# EAGLE design FLD Logic 2 (EAGLE 6.5.0)
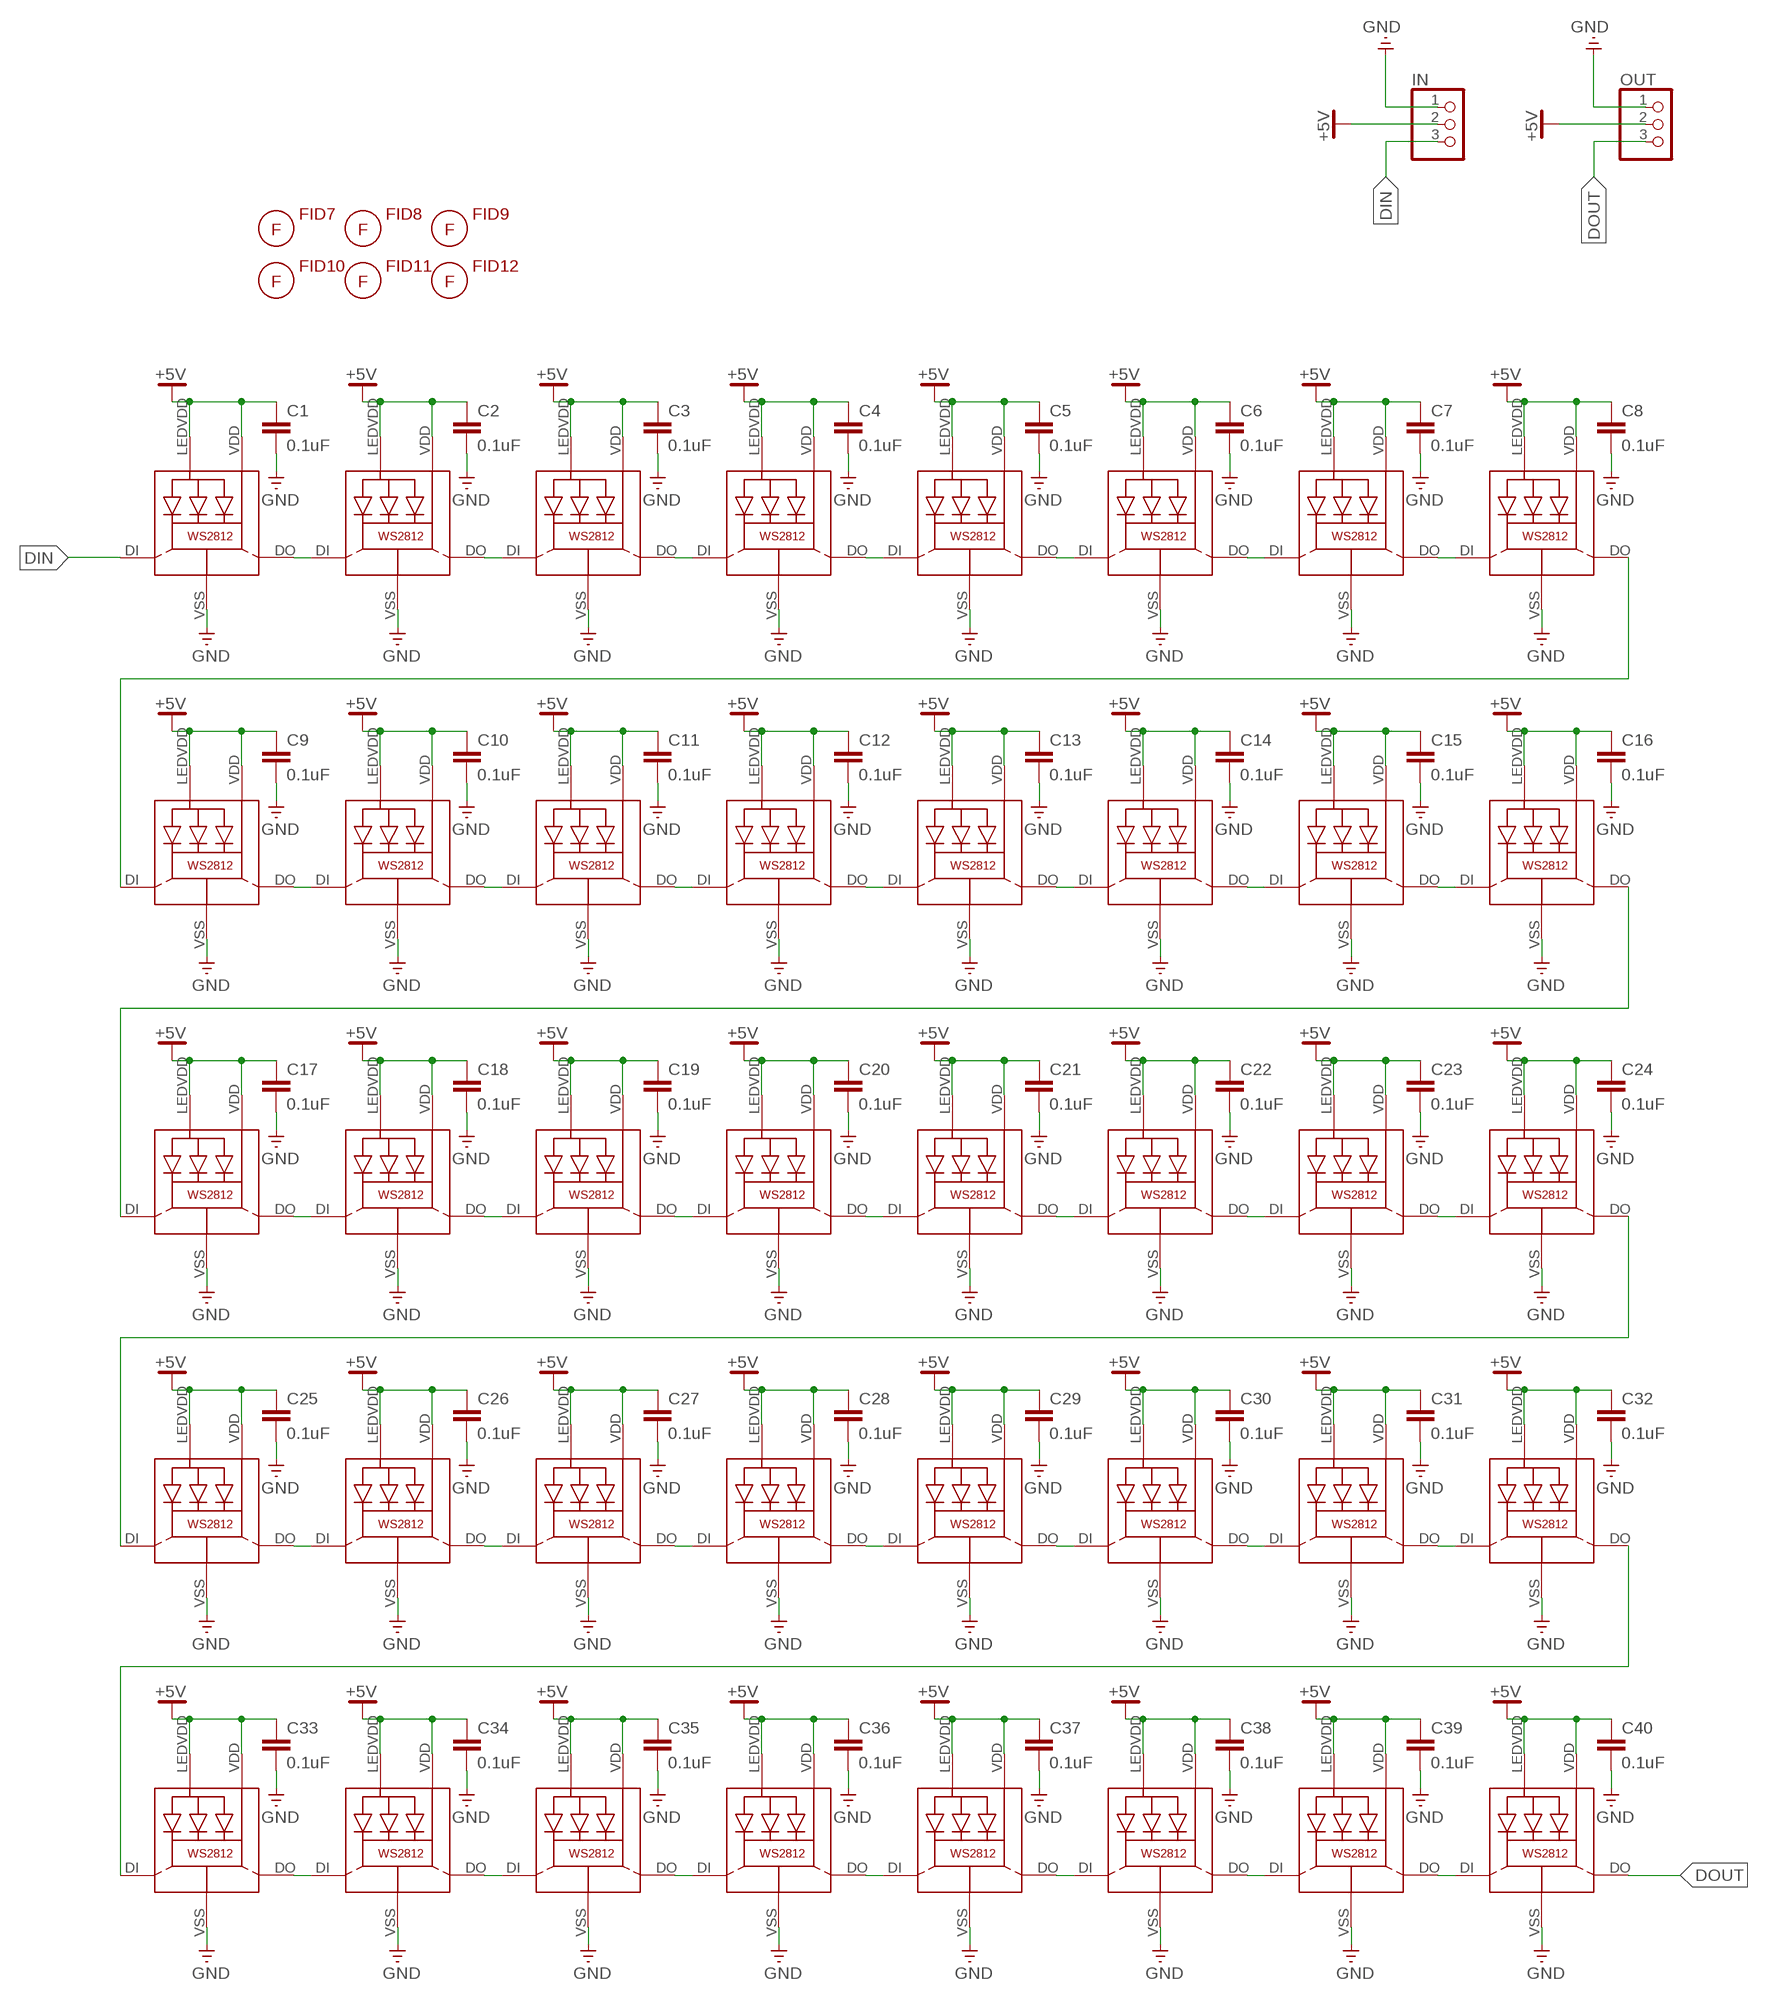
[diagram p0: schematic, sheet 1]

## Parts
C1  0.1uF  CAP0805  [0805]
C2  0.1uF  CAP0805  [0805]
C3  0.1uF  CAP0805  [0805]
C4  0.1uF  CAP0805  [0805]
C5  0.1uF  CAP0805  [0805]
C6  0.1uF  CAP0805  [0805]
C7  0.1uF  CAP0805  [0805]
C8  0.1uF  CAP0805  [0805]
C9  0.1uF  CAP0805  [0805]
C10  0.1uF  CAP0805  [0805]
C11  0.1uF  CAP0805  [0805]
C12  0.1uF  CAP0805  [0805]
C13  0.1uF  CAP0805  [0805]
C14  0.1uF  CAP0805  [0805]
C15  0.1uF  CAP0805  [0805]
C16  0.1uF  CAP0805  [0805]
C17  0.1uF  CAP0805  [0805]
C18  0.1uF  CAP0805  [0805]
C19  0.1uF  CAP0805  [0805]
C20  0.1uF  CAP0805  [0805]
C21  0.1uF  CAP0805  [0805]
C22  0.1uF  CAP0805  [0805]
C23  0.1uF  CAP0805  [0805]
C24  0.1uF  CAP0805  [0805]
C25  0.1uF  CAP0805  [0805]
C26  0.1uF  CAP0805  [0805]
C27  0.1uF  CAP0805  [0805]
C28  0.1uF  CAP0805  [0805]
C29  0.1uF  CAP0805  [0805]
C30  0.1uF  CAP0805  [0805]
C31  0.1uF  CAP0805  [0805]
C32  0.1uF  CAP0805  [0805]
C33  0.1uF  CAP0805  [0805]
C34  0.1uF  CAP0805  [0805]
C35  0.1uF  CAP0805  [0805]
C36  0.1uF  CAP0805  [0805]
C37  0.1uF  CAP0805  [0805]
C38  0.1uF  CAP0805  [0805]
C39  0.1uF  CAP0805  [0805]
C40  0.1uF  CAP0805  [0805]
FID7  FIDUCIAL  [FIDUCIAL_G15]
FID8  FIDUCIAL  [FIDUCIAL_G15]
FID9  FIDUCIAL  [FIDUCIAL_G15]
FID10  FIDUCIAL  [FIDUCIAL_G15]
FID11  FIDUCIAL  [FIDUCIAL_G15]
FID12  FIDUCIAL  [FIDUCIAL_G15]
IN  PINHD-1X3  [1X03]
LED1  WS2812  [WS2812]
LED2  WS2812  [WS2812]
LED3  WS2812  [WS2812]
LED4  WS2812  [WS2812]
LED5  WS2812  [WS2812]
LED6  WS2812  [WS2812]
LED7  WS2812  [WS2812]
LED8  WS2812  [WS2812]
LED9  WS2812  [WS2812]
LED10  WS2812  [WS2812]
LED11  WS2812  [WS2812]
LED12  WS2812  [WS2812]
LED13  WS2812  [WS2812]
LED14  WS2812  [WS2812]
LED15  WS2812  [WS2812]
LED16  WS2812  [WS2812]
LED17  WS2812  [WS2812]
LED18  WS2812  [WS2812]
LED19  WS2812  [WS2812]
LED20  WS2812  [WS2812]
LED21  WS2812  [WS2812]
LED22  WS2812  [WS2812]
LED23  WS2812  [WS2812]
LED24  WS2812  [WS2812]
LED25  WS2812  [WS2812]
LED26  WS2812  [WS2812]
LED27  WS2812  [WS2812]
LED28  WS2812  [WS2812]
LED29  WS2812  [WS2812]
LED30  WS2812  [WS2812]
LED31  WS2812  [WS2812]
LED32  WS2812  [WS2812]
LED33  WS2812  [WS2812]
LED34  WS2812  [WS2812]
LED35  WS2812  [WS2812]
LED36  WS2812  [WS2812]
LED37  WS2812  [WS2812]
LED38  WS2812  [WS2812]
LED39  WS2812  [WS2812]
LED40  WS2812  [WS2812]
OUT  PINHD-1X3  [1X03]

## Nets
+5V [supply]: C1.1 C2.1 C3.1 C4.1 C5.1 C6.1 C7.1 C8.1 C9.1 C10.1 C11.1 C12.1 C13.1 C14.1 C15.1 C16.1 C17.1 C18.1 C19.1 C20.1 C21.1 C22.1 C23.1 C24.1 C25.1 C26.1 C27.1 C28.1 C29.1 C30.1 C31.1 C32.1 C33.1 C34.1 C35.1 C36.1 C37.1 C38.1 C39.1 C40.1 IN.2 LED1.LEDVDD LED1.VDD LED2.LEDVDD LED2.VDD LED3.LEDVDD LED3.VDD LED4.LEDVDD LED4.VDD LED5.LEDVDD LED5.VDD LED6.LEDVDD LED6.VDD LED7.LEDVDD LED7.VDD LED8.LEDVDD LED8.VDD LED9.LEDVDD LED9.VDD LED10.LEDVDD LED10.VDD LED11.LEDVDD LED11.VDD LED12.LEDVDD LED12.VDD LED13.LEDVDD LED13.VDD LED14.LEDVDD LED14.VDD LED15.LEDVDD LED15.VDD LED16.LEDVDD LED16.VDD LED17.LEDVDD LED17.VDD LED18.LEDVDD LED18.VDD LED19.LEDVDD LED19.VDD LED20.LEDVDD LED20.VDD LED21.LEDVDD LED21.VDD LED22.LEDVDD LED22.VDD LED23.LEDVDD LED23.VDD LED24.LEDVDD LED24.VDD LED25.LEDVDD LED25.VDD LED26.LEDVDD LED26.VDD LED27.LEDVDD LED27.VDD LED28.LEDVDD LED28.VDD LED29.LEDVDD LED29.VDD LED30.LEDVDD LED30.VDD LED31.LEDVDD LED31.VDD LED32.LEDVDD LED32.VDD LED33.LEDVDD LED33.VDD LED34.LEDVDD LED34.VDD LED35.LEDVDD LED35.VDD LED36.LEDVDD LED36.VDD LED37.LEDVDD LED37.VDD LED38.LEDVDD LED38.VDD LED39.LEDVDD LED39.VDD LED40.LEDVDD LED40.VDD OUT.2
DIN: IN.3 LED1.DI
DOUT: LED40.DO OUT.3
GND [supply]: C1.2 C2.2 C3.2 C4.2 C5.2 C6.2 C7.2 C8.2 C9.2 C10.2 C11.2 C12.2 C13.2 C14.2 C15.2 C16.2 C17.2 C18.2 C19.2 C20.2 C21.2 C22.2 C23.2 C24.2 C25.2 C26.2 C27.2 C28.2 C29.2 C30.2 C31.2 C32.2 C33.2 C34.2 C35.2 C36.2 C37.2 C38.2 C39.2 C40.2 IN.1 LED1.VSS(GND) LED2.VSS(GND) LED3.VSS(GND) LED4.VSS(GND) LED5.VSS(GND) LED6.VSS(GND) LED7.VSS(GND) LED8.VSS(GND) LED9.VSS(GND) LED10.VSS(GND) LED11.VSS(GND) LED12.VSS(GND) LED13.VSS(GND) LED14.VSS(GND) LED15.VSS(GND) LED16.VSS(GND) LED17.VSS(GND) LED18.VSS(GND) LED19.VSS(GND) LED20.VSS(GND) LED21.VSS(GND) LED22.VSS(GND) LED23.VSS(GND) LED24.VSS(GND) LED25.VSS(GND) LED26.VSS(GND) LED27.VSS(GND) LED28.VSS(GND) LED29.VSS(GND) LED30.VSS(GND) LED31.VSS(GND) LED32.VSS(GND) LED33.VSS(GND) LED34.VSS(GND) LED35.VSS(GND) LED36.VSS(GND) LED37.VSS(GND) LED38.VSS(GND) LED39.VSS(GND) LED40.VSS(GND) OUT.1
N$1: LED1.DO LED2.DI
N$2: LED3.DO LED4.DI
N$3: LED2.DO LED3.DI
N$4: LED5.DO LED6.DI
N$5: LED7.DO LED8.DI
N$6: LED6.DO LED7.DI
N$7: LED4.DO LED5.DI
N$8: LED9.DO LED10.DI
N$9: LED11.DO LED12.DI
N$10: LED10.DO LED11.DI
N$11: LED13.DO LED14.DI
N$12: LED15.DO LED16.DI
N$13: LED14.DO LED15.DI
N$14: LED12.DO LED13.DI
N$15: LED17.DO LED18.DI
N$16: LED19.DO LED20.DI
N$17: LED18.DO LED19.DI
N$18: LED21.DO LED22.DI
N$19: LED23.DO LED24.DI
N$20: LED22.DO LED23.DI
N$21: LED20.DO LED21.DI
N$22: LED25.DO LED26.DI
N$23: LED27.DO LED28.DI
N$24: LED26.DO LED27.DI
N$25: LED29.DO LED30.DI
N$26: LED31.DO LED32.DI
N$27: LED30.DO LED31.DI
N$28: LED28.DO LED29.DI
N$29: LED8.DO LED9.DI
N$30: LED16.DO LED17.DI
N$31: LED24.DO LED25.DI
N$32: LED33.DO LED34.DI
N$33: LED35.DO LED36.DI
N$34: LED34.DO LED35.DI
N$35: LED37.DO LED38.DI
N$36: LED39.DO LED40.DI
N$37: LED38.DO LED39.DI
N$38: LED36.DO LED37.DI
N$39: LED32.DO LED33.DI

## Library data of the parts
C1-C40 = SparkFun-Capacitors:CAP: Capacitor Standard 0603 ceramic capacitor, and 0.1" leaded capacitor.
FID7-FID12 = SmallBatchLibPre1:FIDUCIAL
IN OUT = adafruit:PINHD-1X3: PIN HEADER
LED1-LED40 = rseries:WS2812

## Net classes
1 supply: width 0.406 mm, drill 0.33 mm, clearance 0.203 mm

## Board
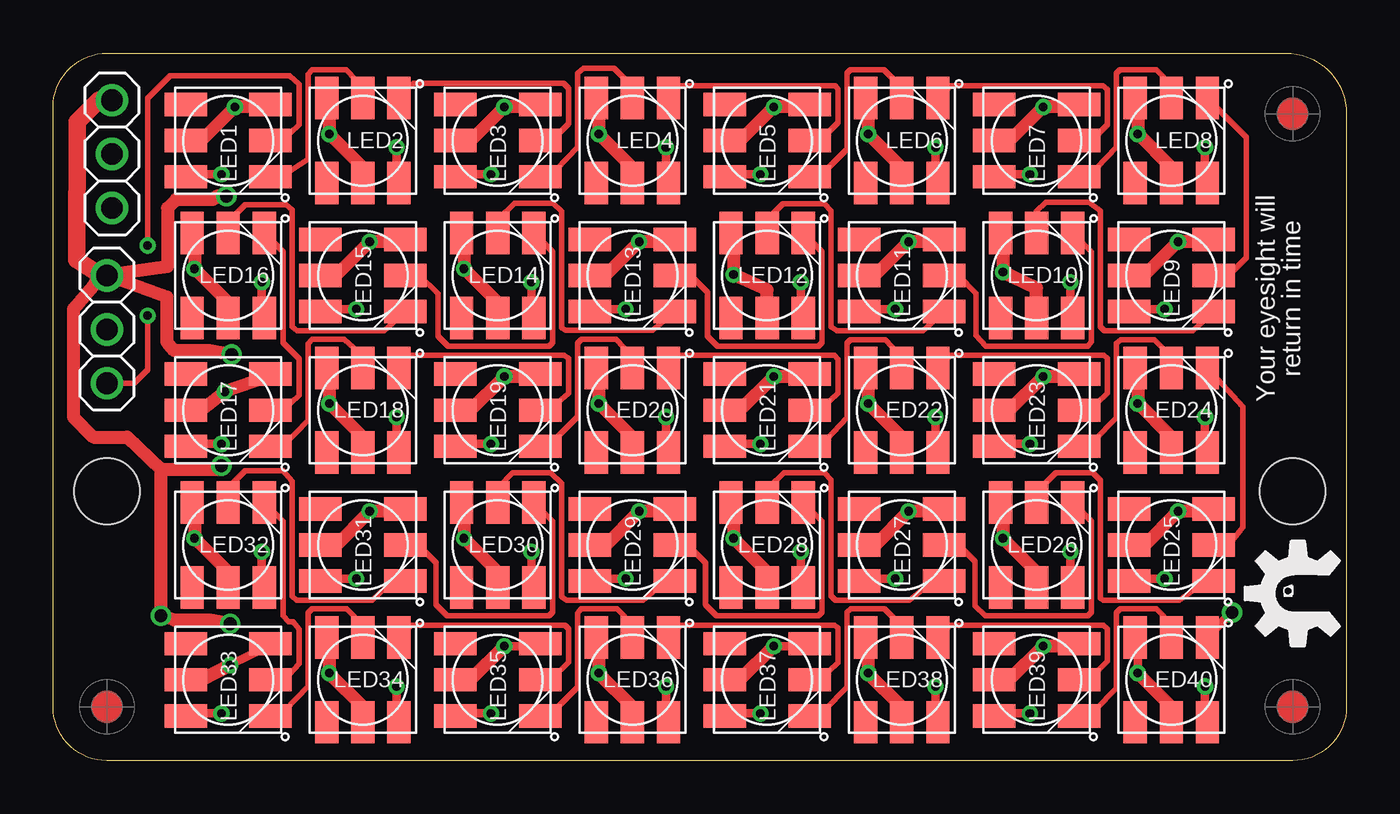
[diagram p1: board, top side]
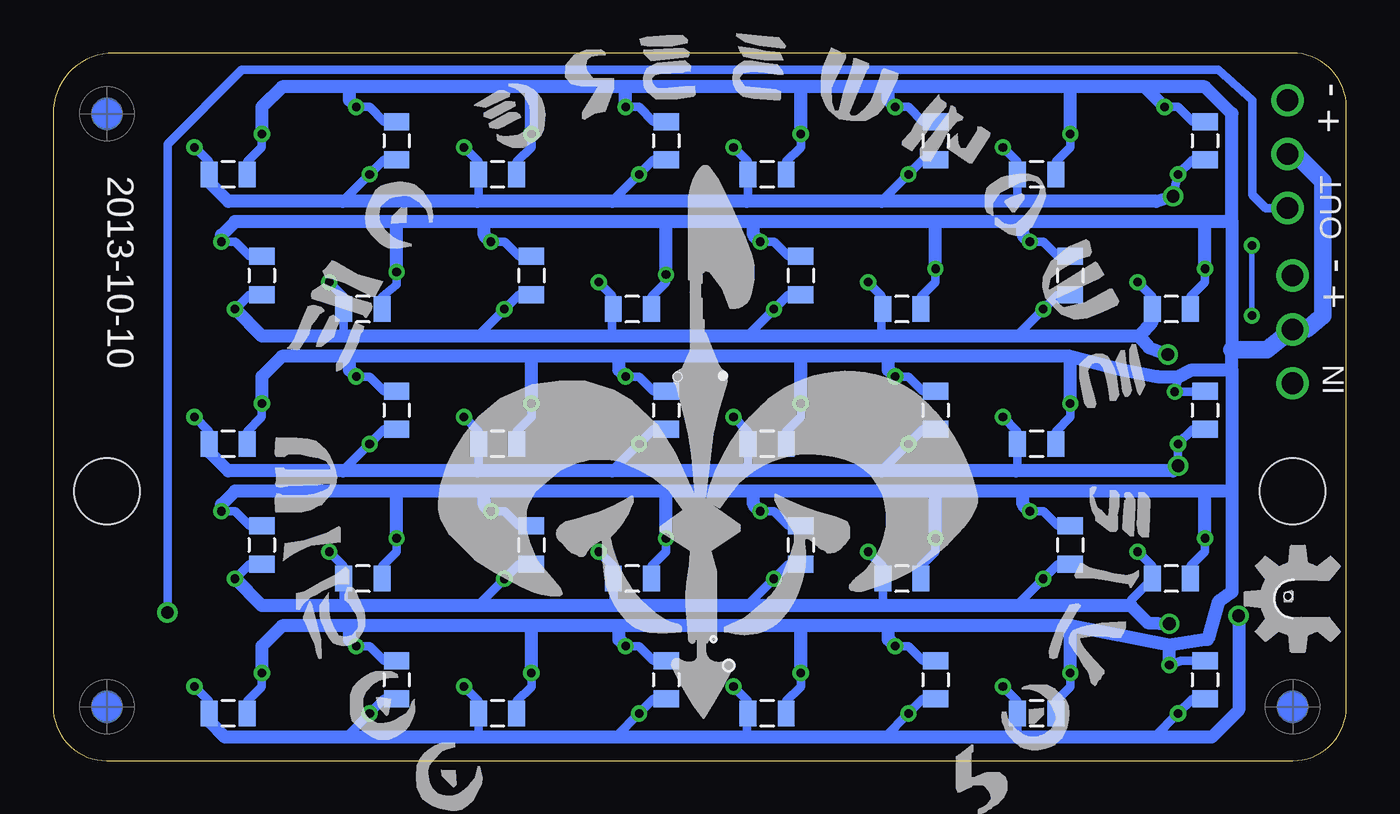
[diagram p2: board, bottom side, seen from below]

Size 60.96 x 33.34 mm. Coordinates in mm from the lower left corner, seen from the top.
Outline: 0,2.54 0,30.78 arc-90 2.56,33.34 58.1,33.34 arc-90 60.96,30.48 60.96,2.54 arc-90 58.42,0 2.54,0 arc-90 0,2.54
Copper layers (1*16): Top 0.0356mm / dielectric 1.5011mm / Bottom 0.0356mm
Design rules "LaenPCBOrder *": minimum track width 10mil, minimum drill 13mil, track to track 6mil, track to pad 6mil, pad to pad 6mil, via to via 6mil, smd to smd 6mil, copper to edge 15mil, drill to drill 6mil, minimum pad ring 7mil, minimum via ring 7mil, stop-mask expansion 4mil, vias tented up to drill 0mil, thermal gap 10mil
Holes 3.1 mm at 2.54,12.7 58.42,12.7

### Footprints (pad centres in the part's own frame; a part is rotated, then mirrored left to right if it is on the bottom)
0805 = smd 0.8 x 1.2: 1 -0.9,0; 2 0.9,0
1X03 = drill 1.016: 1 -2.54,0; 2 0,0; 3 2.54,0
WS2812 = smd 2 x 1.1: DI 2,0; DO 2,-1.7; LEDVDD -2,0; NC -2,1.7; VDD 2,1.7; VSS -2,-1.7

### Placement (x,y rotation side)
C1  6.67,29.21 270 bottom
C2  14.61,27.62 180 bottom
C3  19.37,29.21 270 bottom
C4  27.3,27.62 180 bottom
C5  32.07,29.21 270 bottom
C6  40.01,27.62 180 bottom
C7  44.77,29.21 270 bottom
C8  52.7,27.62 180 bottom
C9  51.12,22.86 270 bottom
C10  46.35,21.27 180 bottom
C11  38.42,22.86 270 bottom
C12  33.66,21.27 180 bottom
C13  25.72,22.86 270 bottom
C14  20.95,21.27 180 bottom
C15  13.02,22.86 270 bottom
C16  8.26,21.27 180 bottom
C17  6.67,16.51 270 bottom
C18  14.61,14.92 180 bottom
C19  19.37,16.51 270 bottom
C20  27.3,14.92 180 bottom
C21  32.07,16.51 270 bottom
C22  40.01,14.92 180 bottom
C23  44.77,16.51 270 bottom
C24  52.7,14.92 180 bottom
C25  51.12,10.16 270 bottom
C26  46.35,8.57 180 bottom
C27  38.42,10.16 270 bottom
C28  33.66,8.57 180 bottom
C29  25.72,10.16 270 bottom
C30  20.95,8.57 180 bottom
C31  13.02,10.16 270 bottom
C32  8.26,8.57 180 bottom
C33  6.67,3.81 270 bottom
C34  14.61,2.22 180 bottom
C35  19.37,3.81 270 bottom
C36  27.3,2.22 180 bottom
C37  32.07,3.81 270 bottom
C38  40.01,2.22 180 bottom
C39  44.77,3.81 270 bottom
C40  52.7,2.22 180 bottom
FID7  2.54,2.54 0 top
FID8  58.42,30.48 0 top
FID9  58.42,2.54 0 top
FID10  2.54,2.54 0 bottom
FID11  58.42,2.54 0 bottom
FID12  58.42,30.48 0 bottom
IN  2.54,20.32 270 top
LED1  8.26,29.21 0 top
LED2  14.61,29.21 90 top
LED3  20.95,29.21 0 top
LED4  27.3,29.21 90 top
LED5  33.66,29.21 0 top
LED6  40.01,29.21 90 top
LED7  46.35,29.21 0 top
LED8  52.7,29.21 90 top
LED9  52.7,22.86 0 top
LED10  46.35,22.86 90 top
LED11  40.01,22.86 0 top
LED12  33.66,22.86 90 top
LED13  27.3,22.86 0 top
LED14  20.95,22.86 90 top
LED15  14.61,22.86 0 top
LED16  8.26,22.86 90 top
LED17  8.26,16.51 0 top
LED18  14.61,16.51 90 top
LED19  20.95,16.51 0 top
LED20  27.3,16.51 90 top
LED21  33.66,16.51 0 top
LED22  40.01,16.51 90 top
LED23  46.35,16.51 0 top
LED24  52.7,16.51 90 top
LED25  52.7,10.16 0 top
LED26  46.35,10.16 90 top
LED27  40.01,10.16 0 top
LED28  33.66,10.16 90 top
LED29  27.3,10.16 0 top
LED30  20.95,10.16 90 top
LED31  14.61,10.16 0 top
LED32  8.26,10.16 90 top
LED33  8.26,3.81 0 top
LED34  14.61,3.81 90 top
LED35  20.95,3.81 0 top
LED36  27.3,3.81 90 top
LED37  33.66,3.81 0 top
LED38  40.01,3.81 90 top
LED39  46.35,3.81 0 top
LED40  52.7,3.81 90 top
OUT  2.78,28.57 270 top
U$1  [ROYAL-ENGINEERS-OF-NABOO-BOTTOM-LARGE]  30.48,0 0 top
U$2  [RSERIES-OSHW-LOGO-MEDIUM-BOTTOM]  59.69,7.87 90 top
U$3  [RSERIES-OSHW-LOGO-MEDIUM-BOTTOM]  1.27,7.62 90 bottom

### Tracks (layer width: path | path; a pad name or v marks a point on that pad's centre or on a via)
+5V  (via drill 0.41)
  Top 0.406: v8.35,4.51 10.14,5.4 LED33.VDD | v21.27,5.4 22.84,5.4 LED35.VDD | 16.49,11.75 LED31.VDD | v33.97,5.4 35.54,5.4 LED37.VDD | 48.24,5.4 LED39.VDD | 29.19,11.75 LED29.VDD | 41.89,11.75 LED27.VDD | v51.12,4.13 51.12,5.7 LED40.VDD | 54.59,11.75 LED25.VDD | 51.12,18.4 LED24.VDD | 54.59,24.45 LED9.VDD | 48.24,18.1 LED23.VDD | 41.89,24.45 LED11.VDD | 35.54,18.1 LED21.VDD | 29.19,24.45 LED13.VDD | 22.84,18.1 LED19.VDD | 16.49,24.45 LED15.VDD | 22.84,30.8 LED3.VDD | 35.54,30.8 LED5.VDD | 48.24,30.8 LED7.VDD | 51.12,31.1 LED8.VDD
  Top 0.61: 22.84,30.8 v21.27,30.8 19.68,29.21 LED3.LEDVDD | 16.49,24.45 v14.92,24.45 13.34,22.86 LED15.LEDVDD | LED14.VDD 19.37,24.75 v19.37,23.18 20.95,21.59 LED14.LEDVDD | 29.19,24.45 v27.62,24.45 26.04,22.86 LED13.LEDVDD | LED4.VDD 25.72,31.1 v25.72,29.53 27.3,27.94 LED4.LEDVDD | 35.54,30.8 v33.97,30.8 32.38,29.21 LED5.LEDVDD | LED12.VDD 32.07,24.75 v32.07,22.9 33.66,22.18 LED12.LEDVDD | LED6.VDD 38.42,31.1 v38.42,29.53 40.01,27.94 LED6.LEDVDD | 48.24,30.8 v46.67,30.8 45.09,29.21 LED7.LEDVDD | 51.12,31.1 v51.12,29.53 52.7,27.94 LED8.LEDVDD | 54.59,24.45 v53.02,24.45 51.44,22.86 LED9.LEDVDD | 41.89,24.45 v40.32,24.45 38.73,22.86 LED11.LEDVDD | 51.12,18.4 v51.12,16.83 52.7,15.24 LED24.LEDVDD | 48.24,18.1 v46.67,18.1 45.09,16.51 LED23.LEDVDD | LED22.VDD 38.42,18.4 v38.42,16.83 40.01,15.24 LED22.LEDVDD | 35.54,18.1 v33.97,18.1 32.38,16.51 LED21.LEDVDD | 54.59,11.75 v53.02,11.75 51.44,10.16 LED25.LEDVDD | LED26.VDD 44.77,12.05 v44.77,10.48 46.35,8.89 LED26.LEDVDD | 41.89,11.75 v40.32,11.75 38.73,10.16 LED27.LEDVDD | LED28.VDD 32.07,12.05 v32.07,10.48 33.66,8.89 LED28.LEDVDD | 29.19,11.75 v27.62,11.75 26.04,10.16 LED29.LEDVDD | LED20.VDD 25.72,18.4 v25.72,16.83 27.3,15.24 LED20.LEDVDD | LED30.VDD 19.37,12.05 v19.37,10.48 20.95,8.89 LED30.LEDVDD | 22.84,18.1 v21.27,18.1 19.68,16.51 LED19.LEDVDD | LED18.VDD 13.02,18.4 v13.02,16.83 14.61,15.24 LED18.LEDVDD | 16.49,11.75 v14.92,11.75 13.34,10.16 LED31.LEDVDD | LED34.VDD 13.02,5.7 v13.02,4.13 14.61,2.54 LED34.LEDVDD | LED36.VDD 25.72,5.7 v25.72,4.13 27.3,2.54 LED36.LEDVDD | LED38.VDD 38.42,5.7 v38.42,4.13 40.01,2.54 LED38.LEDVDD
  Top 0.61: 48.24,5.4 v46.67,5.4 45.09,3.81 LED39.LEDVDD | LED32.VDD 6.67,12.05 v6.67,10.48 8.26,8.89 LED32.LEDVDD | LED17.VDD 10.14,18.1 v8.1,17.38 6.99,16.51 LED17.LEDVDD | LED16.VDD 6.67,24.75 v6.67,23.18 8.26,21.59 LED16.LEDVDD | LED1.VDD 10.14,30.8 v8.57,30.8 6.99,29.21 LED1.LEDVDD | LED2.VDD 13.02,31.1 v13.02,29.53 14.61,27.94 LED2.LEDVDD | LED10.LEDVDD 46.35,22.27 v44.77,23.02 44.77,24.75 LED10.VDD | LED33.LEDVDD 6.99,3.81 v8.35,4.51 | LED40.LEDVDD 52.7,2.54 v51.12,4.13 | LED37.LEDVDD 32.38,3.81 v33.97,5.4 | LED35.LEDVDD 19.68,3.81 v21.27,5.4
  Bottom 0.406: C33.1 7.25,4.71 7.78,4.7 v8.35,4.51 | C34.1 13.71,2.81 13.02,3.49 v13.02,4.13 | C35.1 19.95,4.71 20.64,5.4 v21.27,5.4 | C32.1 7.36,9.15 6.67,9.84 v6.67,10.48 | C31.1 13.6,11.06 14.29,11.75 v14.92,11.75 | C30.1 20.05,9.15 19.37,9.84 v19.37,10.48 | C36.1 26.41,2.81 25.72,3.49 v25.72,4.13 | C37.1 32.65,4.71 33.34,5.4 v33.97,5.4 | C38.1 39.1,2.81 38.42,3.49 v38.42,4.13 | C39.1 45.35,4.71 46.04,5.4 v46.67,5.4 | C29.1 26.3,11.06 26.99,11.75 v27.62,11.75 | C28.1 32.76,9.15 32.07,9.84 v32.07,10.48 | C27.1 39,11.06 39.69,11.75 v40.32,11.75 | C26.1 45.45,9.15 44.77,9.84 v44.77,10.48 | C40.1 51.8,2.81 51.12,3.49 v51.12,4.13 | C25.1 51.7,11.06 52.39,11.75 v53.02,11.75 | C24.1 51.8,15.51 51.12,16.19 v51.12,16.83 | C9.1 51.7,23.76 52.39,24.45 v53.02,24.45 | C10.1 45.45,21.86 44.77,22.42 v44.77,23.02 | C23.1 45.35,17.41 46.04,18.1 v46.67,18.1 | C22.1 39.1,15.51 38.42,16.19 v38.42,16.83 | C11.1 39,23.76 39.69,24.45 v40.32,24.45 | C21.1 32.65,17.41 33.34,18.1 v33.97,18.1 | C20.1 26.41,15.51 25.72,16.19 v25.72,16.83 | C12.1 32.76,21.86 32.07,22.54 v32.07,22.9 | C13.1 26.3,23.76 26.99,24.45 v27.62,24.45 | C14.1 20.05,21.86 19.37,22.54 v19.37,23.18 | C19.1 19.95,17.41 20.64,18.1 v21.27,18.1 | C18.1 13.71,15.51 13.02,16.19 v13.02,16.83 | C15.1 13.6,23.76 14.29,24.45 v14.92,24.45 | C16.1 7.36,21.86 6.67,22.54 v6.67,23.18 | C17.1 7.25,17.41 7.28,17.38 v8.1,17.38 7.94,17.94 7.94,18.1 | C1.1 7.25,30.11 7.94,30.8 v8.57,30.8 | C2.1 13.71,28.2 13.02,28.89 v13.02,29.53 | C3.1 19.95,30.11 20.64,30.8 v21.27,30.8 | C4.1 26.41,28.2 25.72,28.89 v25.72,29.53 | C5.1 32.65,30.11 33.34,30.8 v33.97,30.8 | C6.1 39.1,28.2 38.42,28.89 v38.42,29.53
  Bottom 0.406: C7.1 45.35,30.11 46.04,30.8 v46.67,30.8 | C8.1 51.8,28.2 51.12,28.89 v51.12,29.53
  Bottom 0.61: 9.53,31.75 6.67,31.75 5.4,30.48 5.4,25.4 | 9.53,31.75 13.02,31.75 | 13.02,31.75 21.59,31.75 | 21.59,31.75 25.72,31.75 | 25.72,31.75 33.97,31.75 | 33.97,31.75 38.42,31.75 | 38.42,31.75 46.99,31.75 | 46.99,31.75 50.16,31.75 51.12,30.8 v51.12,29.53 | v13.02,29.53 13.02,31.75 | v21.27,30.8 21.59,31.11 21.59,31.75 | v25.72,29.53 25.72,31.75 | v33.97,30.8 33.97,31.75 | v38.42,29.53 38.42,31.75 | v46.67,30.8 46.99,31.11 46.99,31.75 | 5.4,25.4 6.67,25.4 | 6.67,25.4 15.24,25.4 | 15.24,25.4 19.37,25.4 | 19.37,25.4 27.94,25.4 | 27.94,25.4 32.07,25.4 | 32.07,25.4 40.64,25.4 | 40.64,25.4 44.77,25.4 | 44.77,25.4 52.39,25.4 53.02,24.77 v53.02,24.45 | v14.92,24.45 15.24,24.77 15.24,25.4 | v19.37,23.18 19.37,25.4 | v27.62,24.45 27.94,24.77 27.94,25.4 | v40.32,24.45 40.64,24.77 40.64,25.4 | v32.07,22.9 32.07,25.4 | v44.77,23.02 44.77,25.4 | 13.02,19.05 21.59,19.05 | 21.59,19.05 25.72,19.05 | 25.72,19.05 34.29,19.05 | 34.29,19.05 38.42,19.05 | 38.42,19.05 46.99,19.05 | 46.99,19.05 50.16,19.05 51.12,18.1 v51.12,16.83 | v13.02,16.83 13.02,19.05 | v21.27,18.1 21.59,18.41 21.59,19.05 | v33.97,18.1 34.29,18.41 34.29,19.05 | v46.67,18.1 46.99,18.41 46.99,19.05 | v38.42,16.83 38.42,19.05 | v25.72,16.83 25.72,19.05 | 5.4,12.7 6.67,12.7 | 6.67,12.7 15.24,12.7 | 15.24,12.7 19.37,12.7 | 19.37,12.7 27.94,12.7 | 27.94,12.7 32.07,12.7 | 32.07,12.7 40.64,12.7 | 40.64,12.7 44.77,12.7 | 44.77,12.7 52.39,12.7 53.02,12.06 v53.02,11.75 | v14.92,11.75 15.24,12.06 15.24,12.7 | v19.37,10.48 19.37,12.7 | v27.62,11.75 27.94,12.06 27.94,12.7 | v32.07,10.48 32.07,12.7 | v40.32,11.75 40.64,12.06 40.64,12.7 | v44.77,10.48 44.77,12.7 | v8.35,4.51 8.35,5.43 | 8.35,5.43 13.02,6.35 | 13.02,6.35 21.59,6.35
  Bottom 0.61: 21.59,6.35 25.72,6.35 | 25.72,6.35 34.29,6.35 | 34.29,6.35 38.42,6.35 | 38.42,6.35 46.99,6.35 | 46.99,6.35 50.16,6.35 51.12,5.4 v51.12,4.13 | v13.02,4.13 13.02,6.35 | v21.27,5.4 21.59,5.71 21.59,6.35 | v25.72,4.13 25.72,6.35 | v33.97,5.4 34.29,5.71 34.29,6.35 | v38.42,4.13 38.42,6.35 | v46.67,5.4 46.99,5.71 46.99,6.35 | 5.4,25.4 5.4,19.37 5.4,18.41 | 5.4,18.41 5.4,12.7 | 5.4,12.7 5.4,7.94 6.03,7.49 6.54,5.71 8.35,5.43 | v6.67,10.48 6.67,12.7 | 13.02,19.05 10.56,18.41 8.89,18.1 7.94,18.1 7.3,18.41 5.4,18.41 | v6.67,23.18 6.67,25.4 | v8.57,30.8 9.53,31.75
  Bottom 0.813: OUT.2 2.38,28.57 1.11,27.3 1.11,20.95 1.84,20.35 IN.2 3.75,19.37 5.4,19.37
DIN  (via drill 0.41)
  Top 0.254: LED1.DI 10.8,29.21 11.61,29.97 11.61,31.86 11.14,32.28 5.53,32.28 4.46,31.2 v4.46,24.27 | v4.46,20.97 4.46,18.41 3.83,17.78 IN.3
  Bottom 0.254: v4.46,24.27 v4.46,20.97
DOUT  (via drill 0.6)
  Top 0.406: LED40.DO 54.41,5.83 v55.56,6.99
  Bottom 0.406: v55.56,6.99 55.56,29.05 52.07,32.54 6.03,32.54 4.45,31.11 4.45,26.67 3.81,26.04 OUT.3
GND  (via drill 0.41, 0.6)
  Top 0.406: v7.94,2.22 6.37,2.22 LED33.VSS | v16.19,3.49 16.19,1.92 LED34.VSS | LED35.VSS 19.07,2.22 v20.64,2.22 | v9.84,9.84 9.84,8.27 LED32.VSS | v14.29,8.57 12.72,8.57 LED31.VSS | v22.54,9.84 22.54,8.27 LED30.VSS | LED36.VSS 28.89,1.92 v28.89,3.49 | LED37.VSS 31.77,2.22 v33.34,2.22 | LED39.VSS 44.47,2.22 v46.04,2.22 | v26.99,8.57 25.42,8.57 LED29.VSS | v35.24,9.84 35.24,8.27 LED28.VSS | v39.69,8.57 38.12,8.57 LED27.VSS | v47.94,9.84 47.94,8.27 LED26.VSS | v54.29,3.49 54.29,1.92 LED40.VSS | v52.39,8.57 50.82,8.57 LED25.VSS | v54.29,16.19 54.29,14.62 LED24.VSS | v52.39,21.27 50.82,21.27 LED9.VSS | v47.94,22.54 47.94,20.97 LED10.VSS | LED23.VSS 44.47,14.92 v46.04,14.92 | v41.59,16.19 41.59,14.62 LED22.VSS | v39.69,21.27 38.12,21.27 LED11.VSS | v33.34,14.92 31.77,14.92 LED21.VSS | v28.89,16.19 28.89,14.62 LED20.VSS | v35.24,22.54 35.24,20.97 LED12.VSS | v26.99,21.27 25.42,21.27 LED13.VSS | v22.54,22.54 22.54,20.97 LED14.VSS | v20.64,14.92 19.07,14.92 LED19.VSS | v16.19,16.19 16.19,14.62 LED18.VSS | v14.29,21.27 12.72,21.27 LED15.VSS | v9.84,22.54 9.84,20.97 LED16.VSS | v7.94,14.92 6.37,14.92 LED17.VSS | v7.94,27.62 6.37,27.62 LED1.VSS | v16.19,28.89 16.19,27.32 LED2.VSS | v20.64,27.62 19.07,27.62 LED3.VSS | v28.89,28.89 28.89,27.32 LED4.VSS | v33.34,27.62 31.77,27.62 LED5.VSS | v41.59,28.89 41.59,27.32 LED6.VSS | v46.04,27.62 44.47,27.62 LED7.VSS | v54.29,28.89 54.29,27.32 LED8.VSS | LED38.VSS 41.59,1.92 v41.59,3.49
  Top 0.61: 5.08,13.73 3.49,15.24 1.91,15.24 0.95,16.19 0.95,21.27 1.91,22.38 2.19,22.89 | 5.08,13.73 v5.08,6.83 5.75,6.6 7.43,6.6 v8.35,6.45 | 5.08,13.73 7.78,13.73 v7.94,13.89 | v8.18,26.59 7.7,26.59 7.54,26.43 5.79,26.43 5.4,26.04 5.4,23.27 IN.1 5.37,21.84 5.37,19.72 5.72,19.32 7.38,19.32 v8.41,19.13
  Top 0.813: OUT.1 2.16,31.11 1.14,30.1 1.11,23.59 2.19,22.89 IN.1
  Bottom 0.406: C25.2 51.7,9.26 v52.39,8.57 | C24.2 53.6,15.51 v54.29,16.19 | C9.2 51.7,21.96 v52.39,21.27 | C11.2 39,21.96 v39.69,21.27 40.96,20 41.59,20 | C13.2 26.3,21.96 v26.99,21.27 28.26,20 | C15.2 13.6,21.96 v14.29,21.27 15.56,20 15.88,20 | C17.2 7.25,15.61 v7.94,14.92 v7.94,13.89 | C1.2 7.25,28.31 v7.94,27.62 v8.18,26.59 | C3.2 19.95,28.31 v20.64,27.62 21.91,26.35 | C5.2 32.65,28.31 v33.34,27.62 34.61,26.35 | C8.2 53.6,28.2 v54.29,28.89 | C16.2 9.15,21.86 v9.84,22.54 | C14.2 21.91,21.22 | 21.91,21.22 21.91,20 | 21.91,21.22 21.91,21.91 v22.54,22.54 | C12.2 34.61,21.22 | 34.61,21.22 34.61,20 | 34.61,21.22 34.61,21.91 v35.24,22.54 | 47.31,20 47.26,20.05 C10.2 47.26,21.86 v47.94,22.54 | 40.96,26.35 40.91,26.41 C6.2 40.91,28.2 v41.59,28.89 | 28.26,26.35 28.2,26.41 C4.2 28.2,28.2 v28.89,28.89 | 15.56,26.35 15.51,26.41 C2.2 15.51,28.2 v16.19,28.89 | 47.31,26.35 v46.04,27.62 45.35,28.31 C7.2 | 15.56,13.65 15.51,13.71 C18.2 15.51,15.51 v16.19,16.19 | 21.91,13.65 v20.64,14.92 19.95,15.61 C19.2 | 28.26,13.65 28.2,13.71 C20.2 28.2,15.51 v28.89,16.19 | 34.61,13.65 v33.34,14.92 32.65,15.61 C21.2 | 40.96,13.65 40.91,13.71 C22.2 40.91,15.51 v41.59,16.19 | 47.31,13.65 v46.04,14.92 45.35,15.61 C23.2 | v9.84,9.84 9.15,9.15 C32.2 10.16,7.57 10.16,7.3 | 15.56,7.3 v14.29,8.57 13.6,9.26 C31.2 | 21.91,7.3 21.86,7.36 C30.2 21.86,9.15 v22.54,9.84 | 28.26,7.3 v26.99,8.57 26.3,9.26 C29.2 | 34.61,7.3 34.55,7.36 C28.2 34.55,9.15 v35.24,9.84 | 40.96,7.3 v39.69,8.57 39,9.26 C27.2 | 47.31,7.3 47.26,7.36 C26.2 47.26,9.15 v47.94,9.84 | 15.72,1.11 15.51,1.32 C34.2 15.51,2.81 v16.19,3.49 | C35.2 19.95,2.91 v20.64,2.22 21.75,1.11 21.91,1.11
  Bottom 0.406: 28.26,1.11 28.26,2.17 C36.2 28.2,2.81 v28.89,3.49 | 34.45,1.11 v33.34,2.22 32.65,2.91 C37.2 | 40.96,1.11 40.91,1.16 C38.2 40.91,2.81 v41.59,3.49 | 47.15,1.11 v46.04,2.22 45.35,2.91 C39.2 | 53.6,1.85 53.6,2.81 v54.29,3.49 | 9.05,1.11 v7.94,2.22 7.25,2.91 C33.2
  Bottom 0.61: C8.2 53.6,27.25 52.7,26.35 47.31,26.35 40.96,26.35 34.61,26.35 28.26,26.35 21.91,26.35 15.56,26.35 8.97,26.35 v8.18,26.59 | 9.76,20 15.88,20 21.91,20 28.26,20 34.61,20 41.59,20 47.31,20 51.12,20 v52.39,21.27 | C24.2 53.6,14.55 52.7,13.65 47.31,13.65 40.96,13.65 34.61,13.65 28.26,13.65 21.91,13.65 15.56,13.65 8.18,13.65 v7.94,13.89 | C32.2 9.15,8.31 | v52.39,8.57 51.12,7.3 47.31,7.3 40.96,7.3 34.61,7.3 28.26,7.3 21.91,7.3 15.56,7.3 10.16,7.3 9.37,6.51 v8.35,6.45 | C40.2 53.6,1.85 52.86,1.11 47.15,1.11 40.96,1.11 34.45,1.11 28.26,1.11 21.91,1.11 15.72,1.11 9.05,1.11 6.35,1.11 5.08,2.38 v5.08,6.83 | 9.76,20 9.29,19.45 v8.41,19.13 | 9.76,20 9.15,20.69 C16.2
N$1
  Top 0.254: LED1.DO 10.76,27.51 12.02,28.34 12.02,32.34 12.21,32.54 13.81,32.54 14.29,32.07 14.29,31.99 14.61,31.67 LED2.DI
N$2
  Top 0.254: LED3.DO 23.31,27.86 23.73,27.86 24.73,28.89 24.73,32.38 25,32.62 26.43,32.62 27.3,31.75 LED4.DI
N$3
  Top 0.254: LED2.DO 17,31.91 24.05,31.91 24.29,31.67 24.29,30 23.5,29.21 LED3.DI
N$4
  Top 0.254: LED5.DO 36.01,27.86 36.47,27.86 37.42,28.81 37.42,32.38 37.58,32.54 39.17,32.54 40.01,31.71 LED6.DI
N$5
  Top 0.254: LED7.DO 48.74,27.9 49.17,27.9 50.12,28.89 50.12,32.38 50.28,32.54 51.99,32.54 52.7,31.83 LED8.DI
N$6
  Top 0.254: LED6.DO 42.28,31.79 49.49,31.79 49.69,31.63 49.69,29.96 48.94,29.21 LED7.DI
N$7
  Top 0.254: LED4.DO 29.59,31.79 36.87,31.79 36.99,31.63 36.99,30.04 36.16,29.21 LED5.DI
N$8
  Top 0.254: LED9.DO 53.73,20.25 49.56,20.25 49.37,20.44 49.37,25.92 48.82,26.31 46.79,26.31 46.35,25.88 LED10.DI
N$9
  Top 0.254: LED11.DO 41,20.25 36.94,20.25 36.67,20.44 36.67,25.92 36.35,26.23 34.41,26.23 33.66,25.48 LED12.DI
N$10
  Top 0.254: LED10.DO 48.94,23.98 48.94,19.73 48.78,19.53 43.97,19.53 43.5,20.04 43.5,22.03 42.66,22.86 LED11.DI
N$11
  Top 0.254: LED13.DO 28.26,20.28 24.16,20.27 23.97,20.4 23.97,25.88 23.57,26.27 21.75,26.27 20.95,25.48 LED14.DI
N$12
  Top 0.254: LED15.DO 15.61,20.26 11.51,20.26 11.27,20.44 11.27,25.96 10.99,26.19 9.05,26.19 8.26,25.4 LED16.DI
N$13
  Top 0.254: LED14.DO 23.54,23.98 23.54,19.68 23.38,19.53 18.61,19.53 18.14,20 18.14,21.99 17.26,22.86 LED15.DI
N$14
  Top 0.254: LED12.DO 36.23,23.98 36.23,19.68 36.08,19.53 31.31,19.53 30.84,20 30.84,22.07 30.04,22.86 LED13.DI
N$15
  Top 0.254: LED17.DO 10.84,14.81 12.02,16.03 12.02,19.65 12.21,19.84 13.72,19.84 14.61,19.05 LED18.DI
N$16
  Top 0.254: LED19.DO 23.19,15.04 23.57,15.04 24.72,16.2 24.72,19.66 24.91,19.84 26.53,19.84 27.3,19.03 LED20.DI
N$17
  Top 0.254: LED18.DO 16.89,19.09 24.07,19.09 24.29,18.95 24.29,17.3 23.75,16.84 23.29,16.84 LED19.DI
N$18
  Top 0.254: LED21.DO 35.97,15.12 36.45,15.12 37.42,16.15 37.42,19.68 37.59,19.84 39.22,19.84 39.84,19.17 39.84,18.67 LED22.DI
N$19
  Top 0.254: LED23.DO 48.63,15.08 49.05,15.08 50.13,16.15 50.13,19.67 50.32,19.84 51.91,19.84 52.7,19 LED24.DI
N$20
  Top 0.254: LED22.DO 42.28,19.09 49.52,19.09 49.69,18.97 49.69,17.32 49.2,16.85 48.7,16.85 LED23.DI
N$21
  Top 0.254: LED20.DO 29.59,19.09 36.82,19.09 36.99,18.92 36.99,17.3 36.35,16.72 35.87,16.72 LED21.DI
N$22
  Top 0.254: LED26.DI 46.55,12.36 46.55,12.86 47.27,13.57 49.01,13.57 49.37,13.22 49.37,7.65 49.5,7.56 53.09,7.56 54.32,8.46 LED25.DO
N$23
  Top 0.254: LED28.DI 33.77,12.28 33.77,12.9 34.45,13.57 36.35,13.57 36.67,13.24 36.66,7.76 36.88,7.56 40.36,7.56 41.46,8.46 LED27.DO
N$24
  Top 0.254: LED26.DO 48.94,11.28 48.94,6.99 48.78,6.83 43.93,6.83 43.46,7.3 43.46,9.41 42.7,10.16 LED27.DI
N$25
  Top 0.254: LED30.DI 21.03,12.24 21.03,12.94 21.67,13.57 23.45,13.57 23.97,13.06 23.97,7.72 24.2,7.56 27.81,7.56 28.86,8.46 LED29.DO
N$26
  Top 0.254: LED32.DI 8.37,12.28 8.37,12.98 9.05,13.65 10.84,13.65 11.26,13.17 11.26,7.73 11.49,7.56 15.03,7.56 16.01,8.46 LED31.DO
N$27
  Top 0.254: LED30.DO 23.54,11.28 23.54,6.99 23.38,6.83 18.57,6.83 18.06,7.34 18.06,9.33 17.22,10.16 LED31.DI
N$28
  Top 0.254: LED28.DO 36.23,11.28 36.23,6.99 36.08,6.83 31.27,6.83 30.76,7.34 30.76,9.33 29.92,10.16 LED29.DI
N$29
  Top 0.254: LED8.DO 56.24,29.38 56.24,23.69 55.4,22.86 LED9.DI
N$30
  Top 0.254: LED16.DO 10.84,23.98 10.84,19.68 11.59,18.93 11.59,17.22 10.84,16.51 LED17.DI
N$31
  Top 0.254: LED24.DO 56.08,16.68 56.08,10.99 55.4,10.16 LED25.DI
N$32
  Top 0.254: LED33.DO 10.49,2.34 10.91,2.34 12.02,3.5 12.02,6.97 12.21,7.14 13.83,7.14 14.61,6.35 LED34.DI
N$33
  Top 0.254: LED35.DO 23.31,2.46 23.73,2.46 24.71,3.46 24.71,6.95 24.89,7.14 26.58,7.14 27.3,6.4 LED36.DI
N$34
  Top 0.254: LED34.DO 16.89,6.39 24.12,6.39 24.29,6.22 24.29,4.64 23.55,3.9 23.05,3.9 LED35.DI
N$35
  Top 0.254: LED37.DO 35.93,2.38 36.35,2.38 37.42,3.46 37.42,6.99 37.6,7.14 39.19,7.14 39.98,6.35 39.98,5.84 LED38.DI
N$36
  Top 0.254: LED39.DO 48.63,2.38 49.09,2.38 50.13,3.42 50.13,6.96 50.31,7.14 51.99,7.14 52.7,6.43 LED40.DI
N$37
  Top 0.254: LED38.DO 42.28,6.39 49.5,6.39 49.69,6.22 49.69,4.69 48.89,3.9 48.44,3.9 LED39.DI
N$38
  Top 0.254: LED36.DO 29.59,6.39 36.84,6.39 37.01,6.26 37.01,4.61 36.18,3.84 35.69,3.84 LED37.DI
N$39
  Top 0.254: LED32.DO 10.84,11.28 10.84,6.83 11.11,6.55 11.31,6.55 11.6,6.19 11.6,4.56 10.91,3.81 LED33.DI

### Text on the board
tPlace: Your eyesight will / return in time
bPlace: 2013-10-10
bNames: + - | + -